# EAGLE design MiSTer Vector (EAGLE 7.1.0)
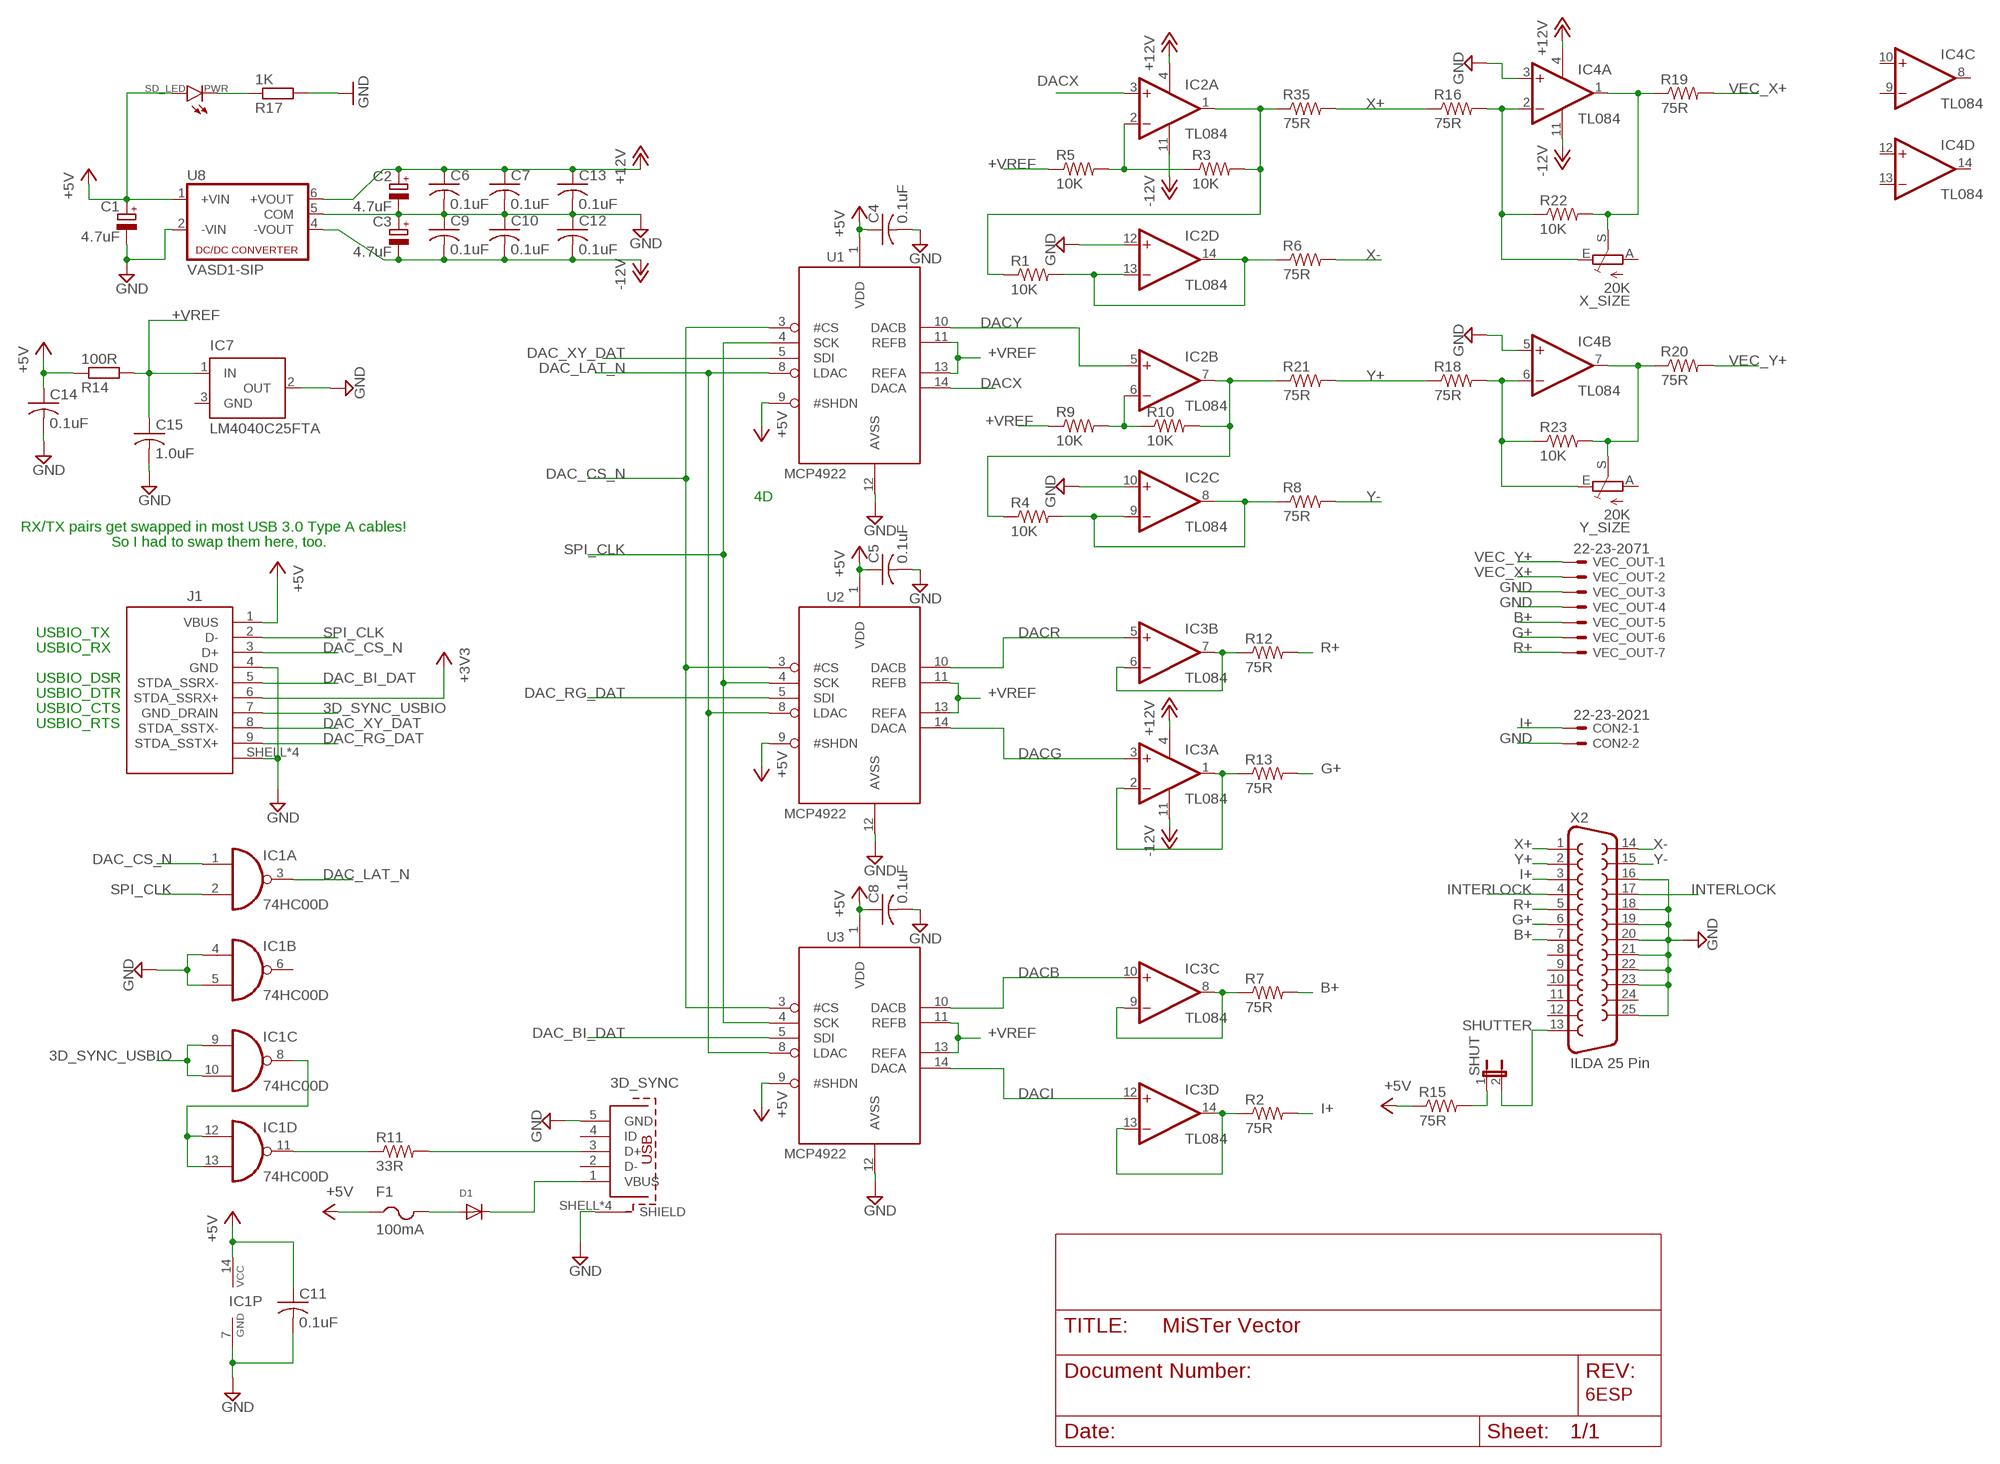
[diagram p0: schematic, sheet 1]

## Parts
3D_SYNC  65100516121  [65100516121]
C1  4.7uF  CPOL-EUCT6032  [CT6032]
C2  4.7uF  CPOL-EUCT6032  [CT6032]
C3  4.7uF  CPOL-EUCT6032  [CT6032]
C4  0.1uF  C-USC0603  [C0603]
C5  0.1uF  C-USC0603  [C0603]
C6  0.1uF  C-USC0603  [C0603]
C7  0.1uF  C-USC0603  [C0603]
C8  0.1uF  C-USC0603  [C0603]
C9  0.1uF  C-USC0603  [C0603]
C10  0.1uF  C-USC0603  [C0603]
C11  0.1uF  C-USC0603  [C0603]
C12  0.1uF  C-USC0603  [C0603]
C13  0.1uF  C-USC0603  [C0603]
C14  0.1uF  C-USC0603  [C0603]
C15  1.0uF  C-USC0603  [C0603]
CON2  22-23-2021  [22-23-2021]
D1  DIODESOD-323F  [SOD-323F]
F1  100mA  PTCFUSE-1206  [R1206]
IC1  74HC00D  [SO14]
IC2  TL084  [SOIC-14]
IC3  TL084  [SOIC-14]
IC4  TL084  [SOIC-14]
IC7  LM4040C25FTA  MAX6520  [SOT23]
J1  692121230100  [692121230100]
PWR  SD_LED  LED0805  [0805_POL]
R1  10K  R-US_R0603  [R0603]
R2  75R  R-US_R0603  [R0603]
R3  10K  R-US_R0603  [R0603]
R4  10K  R-US_R0603  [R0603]
R5  10K  R-US_R0603  [R0603]
R6  75R  R-US_R0603  [R0603]
R7  75R  R-US_R0603  [R0603]
R8  75R  R-US_R0603  [R0603]
R9  10K  R-US_R0603  [R0603]
R10  10K  R-US_R0603  [R0603]
R11  33R  R-US_R0603  [R0603]
R12  75R  R-US_R0603  [R0603]
R13  75R  R-US_R0603  [R0603]
R14  100R  R-EU_R0603  [R0603]
R15  75R  R-US_R0603  [R0603]
R16  75R  R-US_R0603  [R0603]
R17  1K  R-EU_R0603  [R0603]
R18  75R  R-US_R0603  [R0603]
R19  75R  R-US_R0603  [R0603]
R20  75R  R-US_R0603  [R0603]
R21  75R  R-US_R0603  [R0603]
R22  10K  R-US_R0603  [R0603]
R23  10K  R-US_R0603  [R0603]
R35  75R  R-US_R0603  [R0603]
SHUT  JP1E  [JP1]
U1  MCP4922  [SOIC-14]
U2  MCP4922  [SOIC-14]
U3  MCP4922  [SOIC-14]
U8  VASD1-SIP  NMA  [NMA]
VEC_OUT  22-23-2071  [22-23-2071]
X2  ILDA 25 Pin  F25D  [F25D]
X_SIZE  20K  TRIM_EU-B25P  [B25P]
Y_SIZE  20K  TRIM_EU-B25P  [B25P]

## Nets
3D_SYNC_USBIO: IC1.9(C:I0) IC1.10(C:I1) J1.7(GND_DRAIN)
+3V3: J1.6(STDA_SSRX+)
+5V: C1.+ C4.1 C5.1 C8.1 C11.1 C14.1 F1.1 IC1.14(P:VCC) J1.1(VBUS) PWR.+(A) R14.1 R15.1 U1.1(VDD) U1.9(#SHDN) U2.1(VDD) U2.9(#SHDN) U3.1(VDD) U3.9(#SHDN) U8.1(+VIN)
+12V: C2.+ C6.1 C7.1 C13.1 IC2.4(A:V+) IC3.4(A:V+) IC4.4(A:V+) U8.6(+VOUT)
+VREF: C15.1 IC7.1(IN) R5.1 R9.1 R14.2 U1.11(REFB) U1.13(REFA) U2.11(REFB) U2.13(REFA) U3.11(REFB) U3.13(REFA)
-12V: C3.- C9.2 C10.2 C12.2 IC2.11(A:V-) IC3.11(A:V-) IC4.11(A:V-) U8.4(-VOUT)
B1+: IC3.8(C:OUT) IC3.9(C:-IN) R7.1
B+: R7.2 VEC_OUT.5 X2.7
DAC_BI_DAT: J1.5(STDA_SSRX-) U3.5(SDI)
DAC_CS_N: IC1.1(A:I0) J1.3(D+) U1.3(#CS) U2.3(#CS) U3.3(#CS)
DAC_LAT_N: IC1.3(A:O) U1.8(LDAC) U2.8(LDAC) U3.8(LDAC)
DAC_RG_DAT: J1.9(STDA_SSTX+) U2.5(SDI)
DAC_XY_DAT: J1.8(STDA_SSTX-) U1.5(SDI)
DACB: IC3.10(C:+IN) U3.10(DACB)
DACG: IC3.3(A:+IN) U2.14(DACA)
DACI: IC3.12(D:+IN) U3.14(DACA)
DACR: IC3.5(B:+IN) U2.10(DACB)
DACX: IC2.3(A:+IN) U1.14(DACA)
DACY: IC2.5(B:+IN) U1.10(DACB)
G1+: IC3.1(A:OUT) IC3.2(A:-IN) R13.1
G+: R13.2 VEC_OUT.6 X2.6
GND: 3D_SYNC.5(GND) 3D_SYNC.SHELL1(SHIELD) 3D_SYNC.SHELL2(SHIELD) 3D_SYNC.SHELL3(SHIELD) 3D_SYNC.SHELL(SHIELD) C1.- C2.- C3.+ C4.2 C5.2 C6.2 C7.2 C8.2 C9.1 C10.1 C11.2 C12.1 C13.2 C14.2 C15.2 CON2.2 IC1.4(B:I0) IC1.5(B:I1) IC1.7(P:GND) IC2.10(C:+IN) IC2.12(D:+IN) IC4.3(A:+IN) IC4.5(B:+IN) IC7.2(OUT) J1.4(GND) J1.SHELL1(SHIELD) J1.SHELL2(SHIELD) J1.SHELL3(SHIELD) J1.SHELL(SHIELD) R17.2 U1.12(AVSS) U2.12(AVSS) U3.12(AVSS) U8.2(-VIN) U8.5(COM) VEC_OUT.3 VEC_OUT.4 X2.16 X2.18 X2.19 X2.20 X2.21 X2.22 X2.23 X2.25
I1+: IC3.13(D:-IN) IC3.14(D:OUT) R2.1
I+: CON2.1 R2.2 X2.3
INTERLOCK: X2.4 X2.17
N$1: IC2.1(A:OUT) R1.1 R3.2 R35.1
N$2: IC2.7(B:OUT) R4.1 R10.2 R21.1
N$3: IC2.6(B:-IN) R9.2 R10.1
N$4: IC2.8(C:OUT) IC2.9(C:-IN) R4.2 R8.1
N$5: IC2.13(D:-IN) IC2.14(D:OUT) R1.2 R6.1
N$6: 3D_SYNC.1(VBUS) D1.C
N$7: IC1.11(D:O) R11.1
N$8: IC1.8(C:O) IC1.12(D:I0) IC1.13(D:I1)
N$9: 3D_SYNC.3(D+) R11.2
N$10: PWR.-(C) R17.1
N$11: D1.A F1.2
N$12: R15.2 SHUT.1
N$14: IC4.2(A:-IN) R16.2 R22.1 X_SIZE.E
N$15: IC4.6(B:-IN) R18.2 R23.1 Y_SIZE.E
N$16: IC4.7(B:OUT) R20.1 R23.2 Y_SIZE.S
N$17: IC4.1(A:OUT) R19.1 R22.2 X_SIZE.S
N$30: IC2.2(A:-IN) R3.1 R5.2
R1+: IC3.6(B:-IN) IC3.7(B:OUT) R12.1
R+: R12.2 VEC_OUT.7 X2.5
SHUTTER: SHUT.2 X2.13
SPI_CLK: IC1.2(A:I1) J1.2(D-) U1.4(SCK) U2.4(SCK) U3.4(SCK)
VEC_X+: R19.2 VEC_OUT.2
VEC_Y+: R20.2 VEC_OUT.1
X+: R16.1 R35.2 X2.1
X-: R6.2 X2.14
Y+: R18.1 R21.2 X2.2
Y-: R8.2 X2.15
Unconnected: 3D_SYNC.2(D-) 3D_SYNC.4(ID) IC1.6(B:O) IC4.8(C:OUT) IC4.9(C:-IN) IC4.10(C:+IN) IC4.12(D:+IN) IC4.13(D:-IN) IC4.14(D:OUT) X2.8 X2.9 X2.10 X2.11 X2.12 X2.24 X_SIZE.A Y_SIZE.A

## Notes on the sheet
- 4D
- RX/TX pairs get swapped in most USB 3.0 Type A cables!
- So I had to swap them here, too.
- USBIO_TX
- USBIO_RX
- USBIO_DSR
- USBIO_DTR
- USBIO_CTS
- USBIO_RTS
- 6ESP

## Power pins joined to a net without a drawn wire
GND: IC7.3(GND)

## Library data of the parts
3D_SYNC = 632723100011_Eagle_WR-USB_rev19b:65100516121: WR-COM SMT Horizontal 5 Contacts Mini USB Typ B=>Code : Con_I-O_COM_MiniUSB_65100516121 <http://katalog.we-online.de/media/images/eican/Con_I-O_COM_MiniUSB_65100516121_pf2.jpg> Details see: http://katalog.we-online.de/en/em/COM_SMT_MINI_TYPE_B_HORIZONTAL/65100516121 Created 2014-07-09, Karrer Zheng 2014 (C) Würth Elektronik
C1-C3 = rcl:CPOL-EU: POLARIZED CAPACITOR, European symbol
C4-C15 = adafruit:C-US: CAPACITOR, American symbol
CON2 = con-molex:22-23-2021: .100" (2.54mm) Center Header - 2 Pin; MF: MOLEX; MPN: 22-23-2021; OC_FARNELL: 1462926; OC_NEWARK: 25C3832
D1 = adafruit:DIODE: Diode SMADIODE - SMA Surface Mount Package 20V 1A Schottky Diode Digikey: 641-1014-6-ND DO-1N4148 - Through Hole Small Current Diode SOD-123 20V 1 A (.5mV Vf) Schottky Diode - Digikey: MBRX120TPMSCT-ND SOD-323 10V 570mA (.38mV Vf, 3ns) Schottky Diode - Digikey: ZLLS410CT-ND SOD-523 30V 30mA Schottky Diode (RB751S-40TE61) - Digikey: RB751S-40TE61CT-ND SOT23-R/W - SOT23 Package (R = Solder Paste/Reflow Ovens, W = Hand-Soldering) BAT54Film 40V 300mA - Digikey: 497-7162-1-ND
F1 = adafruit:PTCFUSE: PTC fuses, resettable thermistors
IC1 = 74xx-eu:74*00: Quad 2-input NAND gate
IC2-IC4 = favreau:TL084: Texas Instruments TL084 JFET General Purpose Op-Amp
IC7 = maxim:MAX6520: 1.2V Voltage Reference 50ppm/°C, SOT23, 3-Terminal Source: Data sheet <http://datasheets.maxim-ic.com/en/ds/MAX6520.pdf>; MF: MAXIM; MPN: MAX6520EUR-T; OC_FARNELL: unknown; OC_NEWARK: 02J4586
J1 = 632723100011_Eagle_WR-USB_rev19b:692121230100: WR-COM - USB 3.0 HORIZONTAL TYPE A WITH OFFSET 1.04 MM Characteristics MATERIAL PROPERTIES INSULATOR: Color Blue Insulator Material LCP Contact Material Phosphor Bronze Contact Plating Mat Tin over Nickel Contact Type Stamped Cover Material Brass Cover PlatingMat Tin KIND PROPERTIES Quality Class50 000 Mating cycles GENERAL INFORMATION Operating Temperature -20 °C up to +60 °C Insulator Flammability Rating UL94-V0 ELECTRICAL PROPERTIES Rated Current 0.25 A Working Voltage 30 V (AC) Withstanding Voltage 100 V (AC) Contact Resistance 50 mΩ Insulation Resistance 100 MΩ PACKAGING PROPERTIES Packaging Tape and Reel <http://katalog.we-online.de/media/images/v2/Family_WR-COM_692121230100.jpg> Details see: http://katalog.we-online.de/en/em/COM_3_0_TYPE_A_HORIZONTAL_W_OFFSET_1_04MM 2016 (C) Wurth Elektronik
PWR = dan-led:LED: LED
R1-R13 R15 R16 R18-R23 R35 = resistor:R-US_: RESISTOR, American symbol
R14 R17 = rcl:R-EU_: RESISTOR, European symbol
SHUT = jumper:JP1E: JUMPER
U1-U3 = favreau:MCP4922
U8 = dc-dc-converter:NMA: DC-DC CONVERTER; MF: C & D TECHNOLOGIES, INC; MPN: NMA0515SC; OC_FARNELL: 1021434; OC_NEWARK: 61K3064
VEC_OUT = con-molex:22-23-2071: .100" (2.54mm) Center Header - 7 Pin; MF: MOLEX; MPN: 22-23-2071; OC_FARNELL: 1654534; OC_NEWARK: 56H0445
X2 = SparkFun:F25: D-SUB 25 25 Pin male connector. PCB edge mount for regular PCB thicknesses. This connector will connect directly to the back of a PC parallel port or through a normal DB25 extension cable (M/F). SKU: PRT-08287
X_SIZE Y_SIZE = pot:TRIM_EU-: POTENTIOMETER

## Board
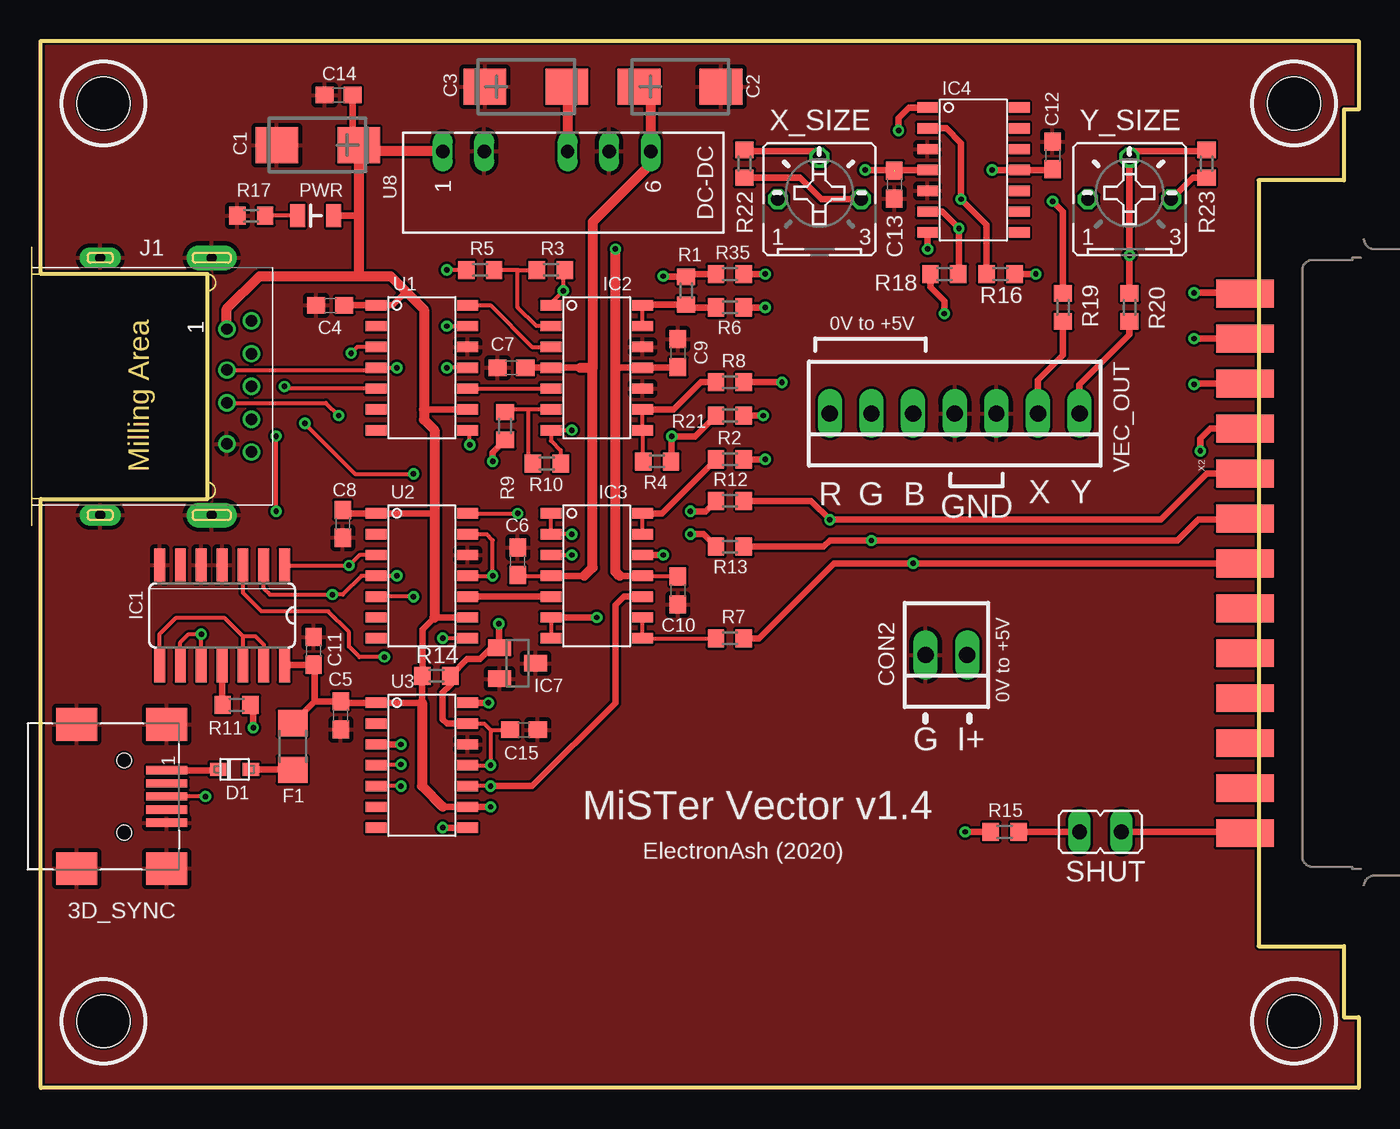
[diagram p1: board, top side]
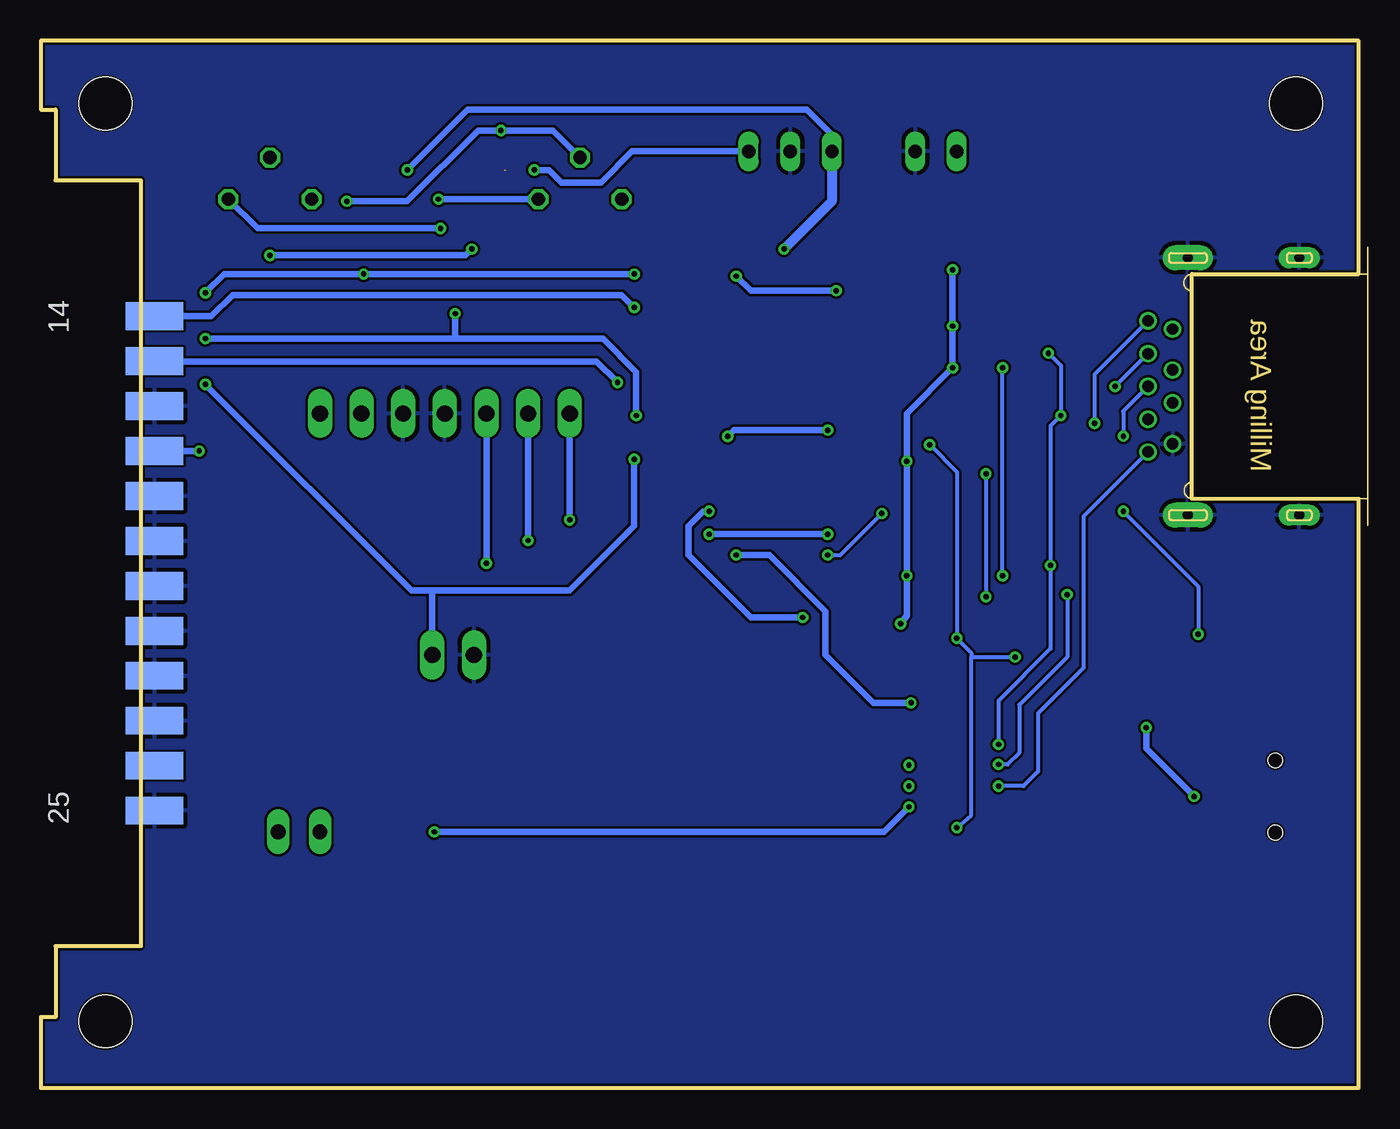
[diagram p2: board, bottom side, seen from below]

Size 80.39 x 63.88 mm. Coordinates in mm from the lower left corner, seen from the top.
Outline: 0,63.88 80.39,63.88 80.39,59.69 79.5,59.69 79.5,55.37 74.3,55.37 74.3,8.64 79.5,8.64 79.5,4.32 80.39,4.32 80.39,0 0,0 0,35.94 10.16,35.94 10.16,49.66 0,49.66 0,63.88
Copper layers (1*16): Top 0.0356mm / dielectric 1.5011mm / Bottom 0.0356mm
Design rules "LaenPCBOrder *": minimum track width 6mil, minimum drill 13mil, track to track 6mil, track to pad 6mil, pad to pad 6mil, via to via 6mil, smd to smd 6mil, copper to edge 5mil, drill to drill 6mil, minimum pad ring 7mil, minimum via ring 7mil, stop-mask expansion 4mil, vias tented up to drill 0mil, thermal gap 10mil
Holes 3.2 mm at 3.81,4.06 3.81,60.07 76.45,4.06 76.45,60.07

### Footprints (pad centres in the part's own frame; a part is rotated, then mirrored left to right if it is on the bottom)
65100516121 = smd 0.5 x 2.5: 1 -1.6,2.6; 2 -0.8,2.6; 3 0,2.6; 4 0.8,2.6; 5 1.6,2.6 | smd 2 x 2.5: SHELL -4.4,2.6; SHELL1 4.4,2.6; SHELL2 -4.4,-2.9; SHELL3 4.4,-2.9 | hole 0.9: -2.2,0; 2.2,0
CT6032 = smd 2.6 x 2.2: + -2.5,0; - 2.5,0
C0603 = smd 1.1 x 1: 1 -0.85,0; 2 0.85,0
22-23-2021 = drill 1 long: 1 -1.27,0; 2 1.27,0
SOD-323F = smd 1 x 0.8: A -1,0; C 1,0
R1206 = smd 1.6 x 1.803: 1 -1.422,0; 2 1.422,0
SO14 = smd 0.66 x 2.032: 1 -3.81,-3.073; 2 -2.54,-3.073; 3 -1.27,-3.073; 4 0,-3.073; 5 1.27,-3.073; 6 2.54,-3.073; 7 3.81,-3.073; 8 3.81,3.073; 9 2.54,3.073; 10 1.27,3.073; 11 0,3.073; 12 -1.27,3.073; 13 -2.54,3.073; 14 -3.81,3.073
SOIC-14 = smd 1.27 x 0.635: 1 -0.762,-0.508; 2 -0.762,-1.778; 3 -0.762,-3.048; 4 -0.762,-4.318; 5 -0.762,-5.588; 6 -0.762,-6.858; 7 -0.762,-8.128; 8 4.826,-8.128; 9 4.826,-6.858; 10 4.826,-5.588; 11 4.826,-4.318; 12 4.826,-3.048; 13 4.826,-1.778; 14 4.826,-0.508
SOT23 = smd 1 x 1.4: 1 -0.95,-1.1; 2 0.95,-1.1; 3 0,1.1
692121230100 = drill 0.7: 1 -3.5,0.93; 2 -1,0.93; 3 1,0.93; 4 3.5,0.93; 5 4,2.43; 6 2,2.43; 7 0,2.43; 8 -2,2.43; 9 -4,2.43 | drill 0.6 pad 1.54 long: SHELL -7.85,0; SHELL1 7.85,0 | drill 0.6 pad 1.27 long: SHELL2 -7.85,-6.8; SHELL3 7.85,-6.8
0805_POL = smd 0.9 x 1.4: + 1.1,0; - -1.1,0
R0603 = smd 1 x 1.1: 1 -0.85,0; 2 0.85,0
JP1 = drill 0.914 long: 1 0,-1.27; 2 0,1.27
NMA = drill 0.813 long: 1 0,6.35; 2 0,3.81; 4 0,-1.27; 5 0,-3.81; 6 0,-6.35
22-23-2071 = drill 1 long: 1 -7.62,0; 2 -5.08,0; 3 -2.54,0; 4 0,0; 5 2.54,0; 6 5.08,0; 7 7.62,0
F25D = smd 1.7 x 3.5: 1 -16.459,-6.045; 2 -13.716,-6.045; 3 -10.973,-6.045; 4 -8.23,-6.045; 5 -5.486,-6.045; 6 -2.743,-6.045; 7 0,-6.045; 8 2.743,-6.045; 9 5.486,-6.045; 10 8.23,-6.045; 11 10.973,-6.045; 12 13.716,-6.045; 13 16.459,-6.045 | smd 1.7 x 3.5 bottom: 14 -15.088,-6.045; 15 -12.344,-6.045; 16 -9.601,-6.045; 17 -6.858,-6.045; 18 -4.115,-6.045; 19 -1.372,-6.045; 20 1.372,-6.045; 21 4.115,-6.045; 22 6.858,-6.045; 23 9.601,-6.045; 24 12.344,-6.045; 25 15.088,-6.045
B25P = drill 0.813 octagon: A -2.54,0; E 2.54,0; S 0,2.54

### Placement (x,y rotation side)
3D_SYNC  5.08,17.78 270 top
C1  16.89,57.53 180 top
C2  38.99,61.09 0 top
C3  29.59,61.09 0 top
C4  17.65,47.75 180 top
C5  18.29,22.73 270 top
C6  29.08,32.13 90 top
C7  28.7,43.94 180 top
C8  18.41,34.42 270 top
C9  38.86,44.83 270 top
C10  38.86,30.35 90 top
C11  16.64,26.67 90 top
C12  61.72,56.9 270 top
C13  52.07,55.12 270 top
C14  18.16,60.58 180 top
C15  29.46,21.84 0 top
CON2  55.24,26.42 180 top
D1  11.81,19.43 180 top
F1  15.37,20.83 270 top
IC1  11.05,28.83 180 top
IC2  31.88,48.26 0 top
IC3  31.88,35.56 0 top
IC4  54.86,60.33 0 top
IC7  29.08,25.91 270 top
J1  10.41,42.8 270 top
PWR  16.76,53.21 0 top
R1  39.37,48.64 270 top
R2  42.04,38.35 0 top
R3  31.11,49.91 0 top
R4  37.59,38.23 180 top
R5  26.8,49.91 0 top
R6  42.04,47.62 0 top
R7  42.04,27.43 0 top
R8  42.04,43.05 0 top
R9  28.32,40.39 90 top
R10  30.86,38.1 0 top
R11  11.94,23.37 0 top
R12  42.04,35.81 0 top
R13  42.04,33.02 0 top
R14  24.13,25.15 0 top
R15  58.8,15.62 0 top
R16  58.55,49.66 180 top
R17  12.83,53.21 180 top
R18  55.12,49.66 0 top
R19  62.36,47.62 270 top
R20  66.42,47.62 270 top
R21  42.04,41.02 0 top
R22  42.93,56.39 90 top
R23  71.12,56.39 90 top
R35  42.04,49.66 0 top
SHUT  64.64,15.62 270 top
U1  21.21,48.26 0 top
U2  21.21,35.56 0 top
U3  21.21,24 0 top
U8  30.86,57.15 90 top
VEC_OUT  55.75,41.15 180 top
X2  79.5,32 270 top
X_SIZE  47.5,54.23 0 top
Y_SIZE  66.42,54.23 0 top

### Tracks (layer width: path | path; a pad name or v marks a point on that pad's centre or on a via)
3D_SYNC_USBIO  (via drill 0.33)
  Top 0.254: IC1.10 v9.78,27.69 9.02,27.69 8.51,27.18 IC1.9 | v14.35,35.18 v14.35,39.77
  Bottom 0.254: v14.35,35.18 9.78,30.61 v9.78,27.69 | J1.7 14.35,41.29 v14.35,39.77
+5V  (via drill 0.33)
  Top 0.254: IC1.14 14.99,25.82
  Top 0.406: 14.99,25.82 C11.1 16.7,25.76 16.7,23.58 | 15.52,22.25 F1.1 16.7,23.58 | R15.1 v56.39,15.62 | PWR.+ 19.39,53.21 | C8.1 18.63,35.05 U2.1 24,35.05 | 16.7,23.58 C5.1 18.5,23.5 U3.1 23.24,23.5 23.24,24.98 R14.1 23.28,27.98 24,28.7 U2.9 | 24.51,17.14 U3.9 v27.43,17.14 | C14.1 19.01,57.91 C1.+ | U1.9 23.37,41.4 | C4.1 U1.1 21.46,47.75 22.29,48.58
  Top 0.61: J1.1 11.34,47.54 13.34,49.53 19.43,49.53 | U8.1 19.77,57.15 C1.+ 19.39,53.21 19.39,49.57 19.43,49.53 | 19.43,49.53 21.34,49.53 22.29,48.58 23.37,47.5 23.37,41.4 23.37,40.77 24,40.13 24,35.05 24,28.7 | 23.24,23.5 23.24,18.41 24.51,17.14
  Bottom 0.406: v56.39,15.62 28.96,15.62 v27.43,17.14
+12V  (via drill 0.33)  (2 unrouted)
  Top 0.254: C6.1 29.12,31.24 IC3.4
  Top 0.406: C6.1 29.17,31.24 | 32.89,43.94 IC2.4 C7.1 | IC4.4 52.11,56.01 | v50.29,56.01 52.03,56.01 | 33.15,31.24 IC3.4
  Top 0.61: C2.+ 37.21,60.54 U8.6 37.21,56.39 33.66,52.83 33.66,43.94 | 33.66,43.94 33.66,31.75 33.15,31.24 | 32.89,43.94 33.66,43.94
  Bottom 0.406: v50.29,56.01 49.4,56.01 48.64,55.24 46.23,55.24 44.32,57.15 U8.6
+VREF  (via drill 0.33)
  Top 0.254: U3.11 v27.43,19.68 27.43,21.84 | U3.13 27.05,22.23 27.43,21.84 | U2.13 27.18,33.78 27.56,33.4 v27.56,31.24 U2.11 | R5.1 v24.77,49.91 | v24.77,46.48 U1.13 | U1.11 v24.77,43.94 | 27.43,21.84 C15.1
  Top 0.406: R9.1 27.56,38.77 v27.56,38.23 | U3.13 24.77,22.23 24.51,22.48 24.51,24.13 24.98,24.6 R14.2 26,26.16 26.8,26.16 27.49,26.86 IC7.1 27.94,26.9 v27.94,28.32
  Bottom 0.406: v24.77,49.91 v24.77,46.48 v24.77,43.94 27.56,41.15 v27.56,38.23 v27.56,31.24 27.56,28.83 v27.94,28.32
-12V  (via drill 0.33)
  Top 0.254: IC3.11 38.82,31.24 C10.2
  Top 0.406: C9.2 38.82,43.94 IC2.11 35.05,43.94 | v58.04,56.01 IC4.11 61.68,56.01 C12.2 | 35.31,31.24 IC3.11
  Top 0.61: C3.- 32.13,60.67 U8.4 | v35.05,51.18 35.05,43.94 35.05,31.5 35.31,31.24
  Bottom 0.406: v58.04,56.01 54.36,59.69 33.66,59.69 32.13,58.17 U8.4
  Bottom 0.61: U8.4 32.13,54.1 v35.05,51.18
B1+
  Top 0.254: IC3.9 IC3.8 R7.1
B+  (via drill 0.33)
  Top 0.406: R7.2 43.81,27.43 48.39,32 v53.21,32 X2.7
  Bottom 0.406: VEC_OUT.5 v53.21,32
DAC_BI_DAT  (via drill 0.33)
  Top 0.254: v21.97,18.41 U3.5
  Bottom 0.254: v21.97,18.41 U3.5 19.56,19.3 19.56,22.86 16.76,25.65 16.76,34.88 J1.5
DAC_CS_N  (via drill 0.33)
  Top 0.254: J1.3 17.38,41.8 v18.16,41.02 | U2.3 19.43,32.51 v18.8,31.88 14.88,31.88 IC1.1 | U1.3 19.3,45.21 v18.92,44.83
  Top 0.406: v21.97,20.95 U3.3
  Bottom 0.254: v18.92,44.83 18.16,44.07 v18.16,41.02 18.8,40.39 v18.8,31.88 18.8,26.8 21.97,23.62 v21.97,20.95
DAC_LAT_N  (via drill 0.33)
  Top 0.254: v26.16,39.24 26.16,40.13 U1.8 | IC1.3 12.32,30.23 13.46,29.08 17.53,29.08 18.8,27.81 18.8,26.92 19.43,26.29 v20.95,26.29 | U2.8 v24.51,27.43
  Top 0.406: v24.51,15.88 U3.8
  Bottom 0.254: 23.62,26.29 v20.95,26.29 | v24.51,15.88 23.62,16.64 23.62,26.29 | 23.62,26.29 23.62,26.54 v24.51,27.43 24.51,37.59 v26.16,39.24
DAC_RG_DAT  (via drill 0.33)
  Top 0.254: v22.73,29.97 U2.5 | v22.73,37.47 19.18,37.47 v16.1,40.55
  Bottom 0.254: v22.73,37.47 v22.73,29.97 | v16.1,40.55 16.1,43.55 J1.9
DAC_XY_DAT  (via drill 0.33)
  Top 0.254: U1.5 14.99,42.67 v14.86,42.8
  Bottom 0.254: v14.86,42.8 12.86,44.8 J1.8
DACB  (via drill 0.33)
  Top 0.254: v27.43,18.41 U3.10
  Top 0.406: v27.43,18.41 29.97,18.41 35.05,23.5 35.05,29.46 35.56,29.97 IC3.10
DACG  (via drill 0.33)
  Top 0.254: IC3.3 v32.38,32.51 | U2.14 v29.08,35.05
  Bottom 0.254: v32.38,32.51 31.62,32.51 v29.08,35.05
DACI  (via drill 0.33)
  Top 0.406: IC3.12 v37.97,32.51 | U3.14 v27.3,23.5
  Bottom 0.406: v27.3,23.5 29.59,23.5 32.51,26.42 32.51,29.08 35.94,32.51 v37.97,32.51
DACR
  Top 0.406: U2.10 IC3.5
DACX
  Top 0.254: U1.14 27.43,47.75 29.97,45.21 IC2.3
DACY
  Top 0.254: U1.10 IC2.5
G1+  (via drill 0.33)
  Top 0.254: IC3.1 IC3.2 v32.38,33.78
  Top 0.406: R13.1 40.42,33.78 v39.62,33.78
  Bottom 0.406: v32.38,33.78 v39.62,33.78
G+  (via drill 0.33)
  Top 0.406: X2.6 73.38,34.67 70.61,34.67 69.34,33.4 v50.67,33.4 48.13,33.4 47.75,33.02 R13.2
  Bottom 0.406: VEC_OUT.6 v50.67,33.4
GND
  pour Bottom (isolate 0.127): 0,63.88 0,49.66 10.16,49.66 10.16,35.94 0,35.94 0,0 80.39,0 80.39,4.32 79.5,4.32 79.5,8.64 74.3,8.64 74.3,55.37 79.5,55.37 79.5,59.69 80.39,59.69 80.39,63.88
  pour Top (isolate 0.127): 0,63.88 0,49.66 10.16,49.66 10.16,35.94 0,35.94 0,0 80.39,0 80.39,4.32 79.5,4.32 79.5,8.64 74.3,8.64 74.3,55.37 79.5,55.37 79.5,59.69 80.39,59.69 80.39,63.88
I1+
  Top 0.254: IC3.13 IC3.14
  Top 0.406: R2.1 37.88,35.05 IC3.14
I+  (via drill 0.33)
  Top 0.406: R2.2 v44.2,38.35 | X2.3 70.41,42.98 v70.36,42.93
  Bottom 0.406: v44.2,38.35 44.2,34.29 48.13,30.35 56.52,30.35 | v70.36,42.93 57.78,30.35 56.52,30.35 | CON2.1 56.52,30.35
INTERLOCK  (via drill 0.33)
  Top 0.406: X2.4 71.35,40.23 70.74,39.62 v70.74,38.86
  Bottom 0.406: X2.17 v70.74,38.86
N$1  (via drill 0.33)
  Top 0.254: IC2.1 31.11,47.88 v31.88,48.64 31.88,49.82 R3.2
  Top 0.406: R35.1 39.54,49.66 R1.1 38.01,49.49 v37.97,49.53
  Bottom 0.406: v31.88,48.64 37.08,48.64 v37.97,49.53
N$2  (via drill 0.33)
  Top 0.254: v32.38,40.13 IC2.7 31.11,39.5 31.71,38.9 R10.2
  Top 0.406: 41.27,41.02 R21.1 | 41.19,40.93 R21.1 | R4.1 38.48,38.27 v38.48,39.75 39.92,39.75 R21.1
  Bottom 0.406: v32.38,40.13 38.1,40.13 v38.48,39.75
N$3
  Top 0.254: IC2.6 29.72,41.4 | 29.72,41.4 28.61,41.4 R9.2 | R10.1 29.72,38.39 29.72,41.4
N$4
  Top 0.254: IC2.9 IC2.8 36.7,38.27 R4.2
  Top 0.406: R8.1 40.26,43.05 38.61,41.4 IC2.9
N$5
  Top 0.254: IC2.13 IC2.14
  Top 0.406: IC2.14 36.74,47.79 R1.2 39.59,47.62 R6.1
N$6
  Top 0.406: 3D_SYNC.1 10.63,19.38 D1.C
N$7
  Top 0.406: IC1.11 11.05,23.41 R11.1
N$8
  Top 0.254: 12.32,27.56 13.08,27.56 13.59,27.05 IC1.13 | 12.32,27.56 IC1.12 | IC1.8 7.24,27.69 8.26,28.7 11.18,28.7 12.32,27.56
N$9  (via drill 0.33)
  Top 0.254: v10.03,17.78 3D_SYNC.3
  Top 0.406: v12.95,21.97 12.95,23.2 R11.2
  Bottom 0.406: v10.03,17.78 12.95,20.7 v12.95,21.97
N$10
  Top 0.254: PWR.- R17.1
N$11
  Top 0.406: D1.A 15.34,19.43 F1.2
N$12
  Top 0.406: R15.2 SHUT.1
N$14  (via drill 0.33)
  Top 0.406: IC4.2 55.24,58.55 56.13,57.66 v56.13,54.23 57.7,52.67 R16.2 | R22.1 46.32,55.54 47.62,54.23 X_SIZE.E
  Bottom 0.406: X_SIZE.E v56.13,54.23
N$15  (via drill 0.33)
  Top 0.406: IC4.6 54.99,53.47 v56.01,52.45 56.01,49.7 R18.2 | R23.1 70.27,55.54 Y_SIZE.E
  Bottom 0.406: Y_SIZE.E 67.18,52.45 v56.01,52.45
N$16  (via drill 0.33)
  Top 0.406: R20.1 v66.42,50.8 Y_SIZE.S 66.8,57.15 71.03,57.15 R23.2 | IC4.7 v54.1,51.18
  Bottom 0.406: v54.1,51.18 54.48,50.8 v66.42,50.8
N$17  (via drill 0.33)
  Top 0.406: v52.32,58.42 52.32,59.18 52.96,59.82 IC4.1 | v61.72,54.1 62.36,53.47 R19.1 | X_SIZE.S 47.12,57.15 43.01,57.15 R22.2
  Bottom 0.406: X_SIZE.S 49.15,58.42 v52.32,58.42 53.72,58.42 58.04,54.1 v61.72,54.1
N$30
  Top 0.254: 29.08,49.91 R3.1 | IC2.2 30.23,46.48 29.08,47.62 29.08,49.91 | 27.56,49.74 R5.2 29.08,49.91
R1+  (via drill 0.33)
  Top 0.254: IC3.6 IC3.7
  Top 0.406: R12.1 40.55,35.18 v39.62,35.18 | IC3.6 v33.91,28.7
  Bottom 0.406: v33.91,28.7 37.08,28.7 40.89,32.51 40.89,34.29 40.01,35.18 v39.62,35.18
R+  (via drill 0.33)
  Top 0.406: 73.43,37.47 X2.5 71.14,37.49 68.33,34.67 v48.13,34.67 46.99,35.81 R12.2
  Bottom 0.406: VEC_OUT.7 v48.13,34.67
SHUTTER
  Top 0.406: SHUT.2 73.38,15.62 X2.13
SPI_CLK  (via drill 0.33)
  Top 0.254: v21.72,31.24 U2.4 19.56,31.24 18.41,30.1 v17.78,30.1 13.97,30.1 13.59,30.48 IC1.2 | v21.72,43.94 U1.4 20.3,43.8 J1.2 | U3.4 20.5,19.73 v21.97,19.73
  Bottom 0.254: v21.72,31.24 v21.72,43.94 | v17.78,30.1 17.78,26.29 20.7,23.37 20.7,20.45 21.41,19.73 v21.97,19.73
VEC_X+
  Top 0.406: VEC_OUT.2 60.83,43.18 62.36,44.7 R19.2
VEC_Y+
  Top 0.406: R20.2 66.42,45.97 63.37,42.93 VEC_OUT.1
X+  (via drill 0.33)
  Top 0.406: 73.25,48.26 X2.1 73.41,48.51 v70.36,48.51 | R35.2 v44.2,49.66 | R16.1 v60.71,49.66
  Bottom 0.406: v44.2,49.66 53.47,49.66 v60.71,49.66 69.22,49.66 v70.36,48.51
X-  (via drill 0.33)
  Top 0.406: R6.2 v44.2,47.62
  Bottom 0.406: 73.43,47.12 X2.14 70,47.09 68.71,48.39 44.96,48.39 v44.2,47.62
Y+  (via drill 0.33)
  Top 0.406: v70.36,45.72 X2.2 | R21.2 v44.07,41.02 | R18.1 54.27,48.86 55.12,48.01 v55.12,47.24
  Bottom 0.406: v44.07,41.02 44.07,43.69 46.1,45.72 55.12,45.72 | 55.12,45.72 v55.12,47.24 | v70.36,45.72 55.12,45.72
Y-  (via drill 0.33)
  Top 0.406: R8.2 v45.21,43.05
  Bottom 0.406: X2.15 73.43,44.32 46.48,44.32 v45.21,43.05

### Text on the board
tPlace: 0V to +5V | R | G | B | X | Y | GND | 0V to +5V | G | I+ | MiSTer Vector v1.4 | ElectronAsh (2020)
bNames: SDA | SCL | G | 5V
TallParts: USB | ISP | PWR
ArduinoHoles: 3.2mm | 2.2mm | 3.2mm